# EAGLE design PS4-sequencer (EAGLE 9.7.0)
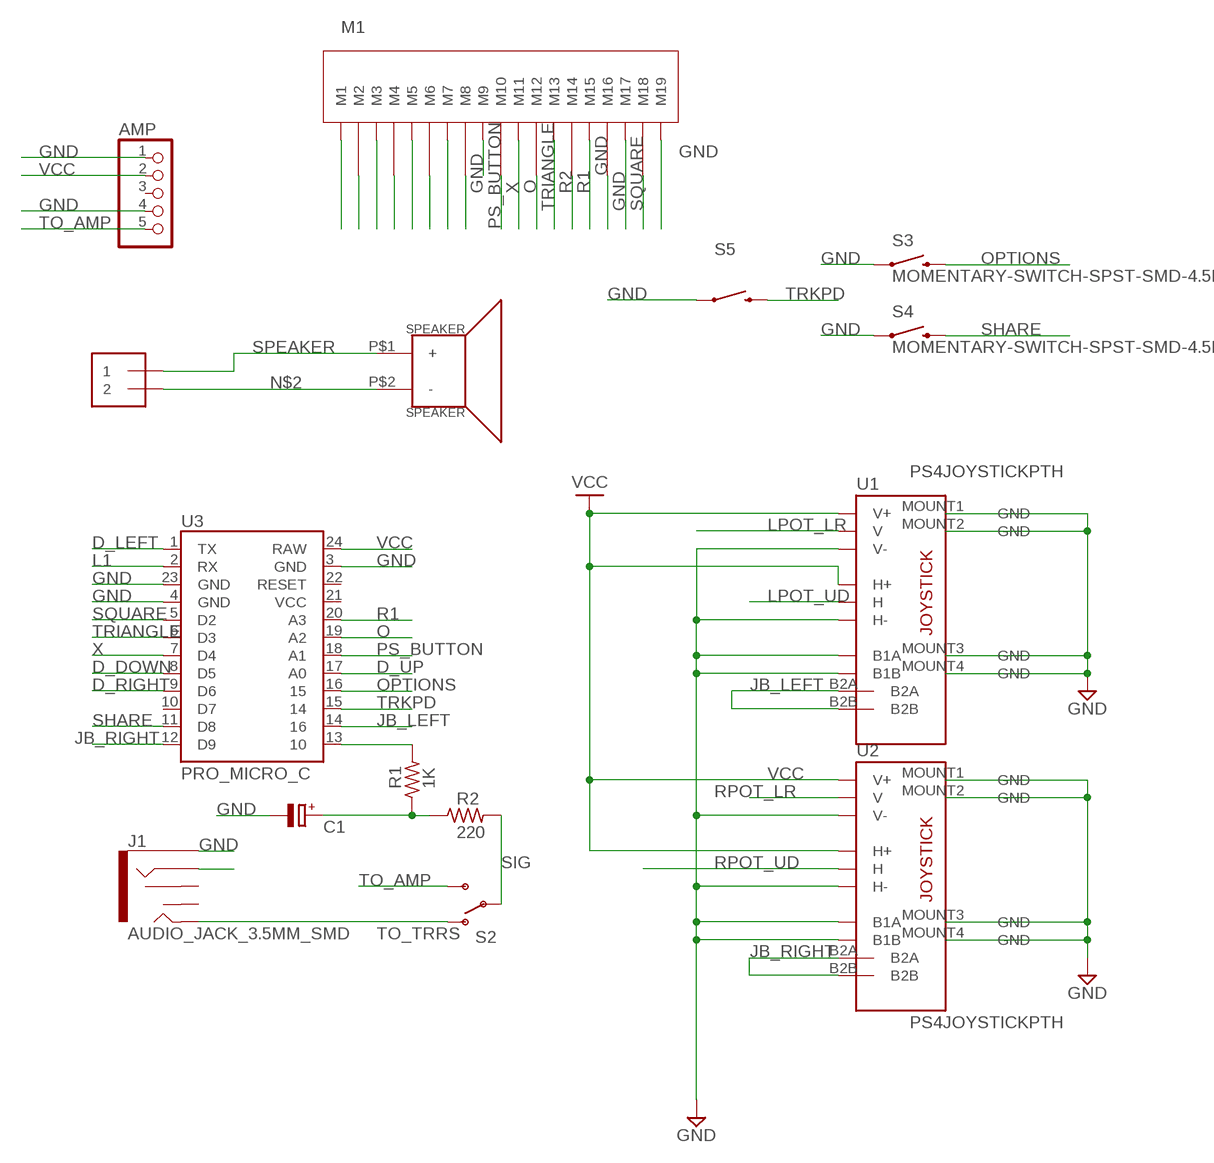
[diagram p0: schematic, sheet 1]

## Parts
AMP  PINHD-1X5  [1X05]
C1  CAPACITOR-POLRADIAL-5MM-DIA  [CAPPRD254W65D500H1150B]
J1  AUDIO_JACK_3.5MM_SMD  [AUDIO-JACK-3.5MM-SMD]
J2  1X2-3.5MM  [1X2-3.5MM]
M1  PS4MEMBRANE  [PS4MEMBRANE]
R1  1K  R-US_AXIAL-7.2MM-PITCH  [RESAD724W46L381D178B]
R2  220  R-US_AXIAL-7.2MM-PITCH  [RESAD724W46L381D178B]
S2  SWITCH-SPDTSMD  [SWITCH_SPDT_SMD]
S3  MOMENTARY-SWITCH-SPST-SMD-4.5MM  [TACTILE_SWITCH_SMD_3.6MM]
S4  MOMENTARY-SWITCH-SPST-SMD-4.5MM  [TACTILE_SWITCH_SMD_3.6MM]
S5  TAC_SWITCHSMD  MOMENTARY-SWITCH-SPST-SMD-5.2MM  [TACTILE_SWITCH_SMD_6MM]
SPEAKER  SPEAKER  [PS4_SPEAKER]
U1  PS4JOYSTICKPTH  [PS4JOYSTICK]
U2  PS4JOYSTICKPTH  [PS4JOYSTICK]
U3  PRO_MICRO_C  [PRO_MICRO_C]

## Nets
D_DOWN: M1.8(M8) U3.8(D5)
D_LEFT: M1.7(M7) U3.1(TX)
D_RIGHT: M1.5(M5) U3.9(D6)
D_UP: M1.6(M6) U3.17(A0)
GND: AMP.1 AMP.4 C1.2(-) J1.SLEEVE M1.3(M3) M1.9(M9) M1.16(M16) M1.17(M17) M1.19(M19) S3.2 S3.3 S4.2 S4.3 S5.1 U1.B1A U1.B1B U1.H3(H-) U1.MOUNT1(GND) U1.MOUNT2(GND) U1.MOUNT3(GND) U1.MOUNT4(GND) U1.V3(V-) U2.B1A U2.B1B U2.H3(H-) U2.MOUNT1(GND) U2.MOUNT2(GND) U2.MOUNT3(GND) U2.MOUNT4(GND) U2.V3(V-) U3.3(GND) U3.4(GND) U3.23(GND)
JB_LEFT: U1.B2A U1.B2B U3.14
JB_RIGHT: U2.B2A U2.B2B U3.12(D9)
L1: M1.2(M2) U3.2(RX)
L2: M1.1(M1)
LPOT_LR: U1.V2(V)
LPOT_UD: U1.H2(H)
N$1: C1.1(+) R1.1 R2.1
N$2: J2.2 SPEAKER.P$2(-)
N$4: J1.RING1(RING)
N$8: R1.2 U3.13
N$24: M1.4(M4)
O: M1.12(M12) U3.19(A2)
OPTIONS: S3.1 S3.4 U3.16
PS_BUTTON: M1.10(M10) U3.18(A1)
R1: M1.15(M15) U3.20(A3)
R2: M1.14(M14)
RPOT_LR: U2.V2(V)
RPOT_UD: U2.H2(H)
SHARE: S4.1 S4.4 U3.11(D8)
SIG: R2.2 S2.2(P)
SPEAKER: J2.1 SPEAKER.P$1(+)
SQUARE: M1.18(M18) U3.5(D2)
TO_AMP: AMP.5 S2.3(S)
TO_TRRS: J1.TIP S2.1(O)
TRIANGLE: M1.13(M13) U3.6(D3)
TRKPD: S5.3 U3.15
VCC: AMP.2 U1.H1(H+) U1.V1(V+) U2.H1(H+) U2.V1(V+) U3.24(RAW)
X: M1.11(M11) U3.7(D4)
Unconnected: AMP.3 J1.RSH J1.TSH U3.10(D7) U3.21(VCC) U3.22(RESET)

## Library data of the parts
AMP = pinhead:PINHD-1X5: PIN HEADER
C1 = Tinkercad:CAPACITOR-POL: Capacitor Polarised - Generic
J1 = controller:AUDIO_JACK_3.5MM: Audio Jack 3.5mm variants of PTH and SMT stereo audio jack with bypass switches. SparkFun Products: SparkFun SparkPunk Sound Kit <[https://www.sparkfun.com/products/11177]> - PTH MP3 Trigger <https://www.sparkfun.com/products/13720> -3.5mm SMD SparkFun PicoBoard <https://www.sparkfun.com/products/11888>- 2.5mm SMD; PROD_ID: CONN-10353
J2 = adafruit:1X2: 3.5mm Terminal block http://www.ladyada.net/library/pcb/eaglelibrary.html
M1 = controller:PS4MEMBRANE
R1 R2 = Tutorial - Fusion 360:R-US: Resistor Fixed - ANSI; CATEGORY: Resistor; SUB-CATEGORY: Fixed
S2 = controller:SWITCH-SPDT: SPDT Switch Simple slide switch, Spark Fun Electronics SKU : COM-00102 DPDT SMT slide switch, AYZ0202, SWCH-08179
S3 S4 = controller:MOMENTARY-SWITCH-SPST: Momentary Switch (Pushbutton) - SPST Normally-open (NO) SPST momentary switches (buttons, pushbuttons). Variants PTH-12MM - 12mm square, through-hole Momentary Pushbutton Switch - 12mm Square <https://www.sparkfun.com/products/9190> (COM-09190) PTH-6.0MM, PTH-6.0MM-KIT - 6.0mm square, through-hole Mini Pushbutton Switch <https://www.sparkfun.com/products/97> (COM-00097) KIT package intended for soldering kit's - only one side of pads' copper is exposed. PTH-RIGHT-ANGLE-KIT - Right-angle, through-hole Right Angle Tactile Button <https://www.sparkfun.com/products/10791> - Used on SparkFun BigTime Watch Kit <https://www.sparkfun.com/products/11734> SMD-12MM - 12mm square, surface-mount Tactile Button - SMD (12mm) <https://www.sparkfun.com/products/12993> (COM-12993) Used on SparkFun PicoBoard <https://www.sparkfun.com/products/11888> SMD-4.5MM - 4.5mm Square Trackball Switch Used on SparkFun Blackberry Trackballer Breakout <https://www.sparkfun.com/products/13169> SMD-4.6MMX2.8MM - 4.60mm x 2.80mm, surface mount Used on SparkFun SAMD21 Mini Breakout <https://www.sparkfun.com/products/13664> SMD-5.2MM, SMD-5.2-REDUNDANT - 5.2mm square, surface-mount Mini Pushbutton Switch - SMD <https://www.sparkfun.com/products/8720> (COM-08720) Used on Arduino Pro Mini <https://www.sparkfun.com/products/11114> REDUNDANT package connects both switch circuits together SMD-6.0X3.5MM - 6.0 x 3.5mm, surface mount Momentary Reset Switch SMD <https://www.sparkfun.com/products/8229> (COM-08229) SMD-6.2MM-TALL - 6.2mm square, surface mount Tactile Button - SMD (6mm) <https://www.sparkfun.com/products/12992> Used on SparkFun Digital Sandbox <https://www.sparkfun.com/products/12651> SMD-RIGHT-ANGLE - Right-angle, surface mount Used on SparkFun Block for Intel® Edison - Arduino <https://www.sparkfun.com/products/13036>; PROD_ID: SWCH-09213
S5 = controller:MOMENTARY-SWITCH-SPST: Momentary Switch (Pushbutton) - SPST Normally-open (NO) SPST momentary switches (buttons, pushbuttons). Variants PTH-12MM - 12mm square, through-hole Momentary Pushbutton Switch - 12mm Square <https://www.sparkfun.com/products/9190> (COM-09190) PTH-6.0MM, PTH-6.0MM-KIT - 6.0mm square, through-hole Mini Pushbutton Switch <https://www.sparkfun.com/products/97> (COM-00097) KIT package intended for soldering kit's - only one side of pads' copper is exposed. PTH-RIGHT-ANGLE-KIT - Right-angle, through-hole Right Angle Tactile Button <https://www.sparkfun.com/products/10791> - Used on SparkFun BigTime Watch Kit <https://www.sparkfun.com/products/11734> SMD-12MM - 12mm square, surface-mount Tactile Button - SMD (12mm) <https://www.sparkfun.com/products/12993> (COM-12993) Used on SparkFun PicoBoard <https://www.sparkfun.com/products/11888> SMD-4.5MM - 4.5mm Square Trackball Switch Used on SparkFun Blackberry Trackballer Breakout <https://www.sparkfun.com/products/13169> SMD-4.6MMX2.8MM - 4.60mm x 2.80mm, surface mount Used on SparkFun SAMD21 Mini Breakout <https://www.sparkfun.com/products/13664> SMD-5.2MM, SMD-5.2-REDUNDANT - 5.2mm square, surface-mount Mini Pushbutton Switch - SMD <https://www.sparkfun.com/products/8720> (COM-08720) Used on Arduino Pro Mini <https://www.sparkfun.com/products/11114> REDUNDANT package connects both switch circuits together SMD-6.0X3.5MM - 6.0 x 3.5mm, surface mount Momentary Reset Switch SMD <https://www.sparkfun.com/products/8229> (COM-08229) SMD-6.2MM-TALL - 6.2mm square, surface mount Tactile Button - SMD (6mm) <https://www.sparkfun.com/products/12992> Used on SparkFun Digital Sandbox <https://www.sparkfun.com/products/12651> SMD-RIGHT-ANGLE - Right-angle, surface mount Used on SparkFun Block for Intel® Edison - Arduino <https://www.sparkfun.com/products/13036>; PROD_ID: SWCH-08247; SF_SKU: COM-08720
SPEAKER = controller:SPEAKER: Speaker Generic 2-terminal loudspeakers SparkFun Products Speaker - PCB Mount <https://www.sparkfun.com/products/11089> (COM-11089)
U1 U2 = ps4joystick:PS4JOYSTICK: Thumb Joystick Joystick commonly found in PS2 controllers. Two pots and a select switch. Adapted from Sparkfun Library (but for more common 6mm switch sticks)
U3 = SparkFun-Boards:PRO_MICRO_C

## Board
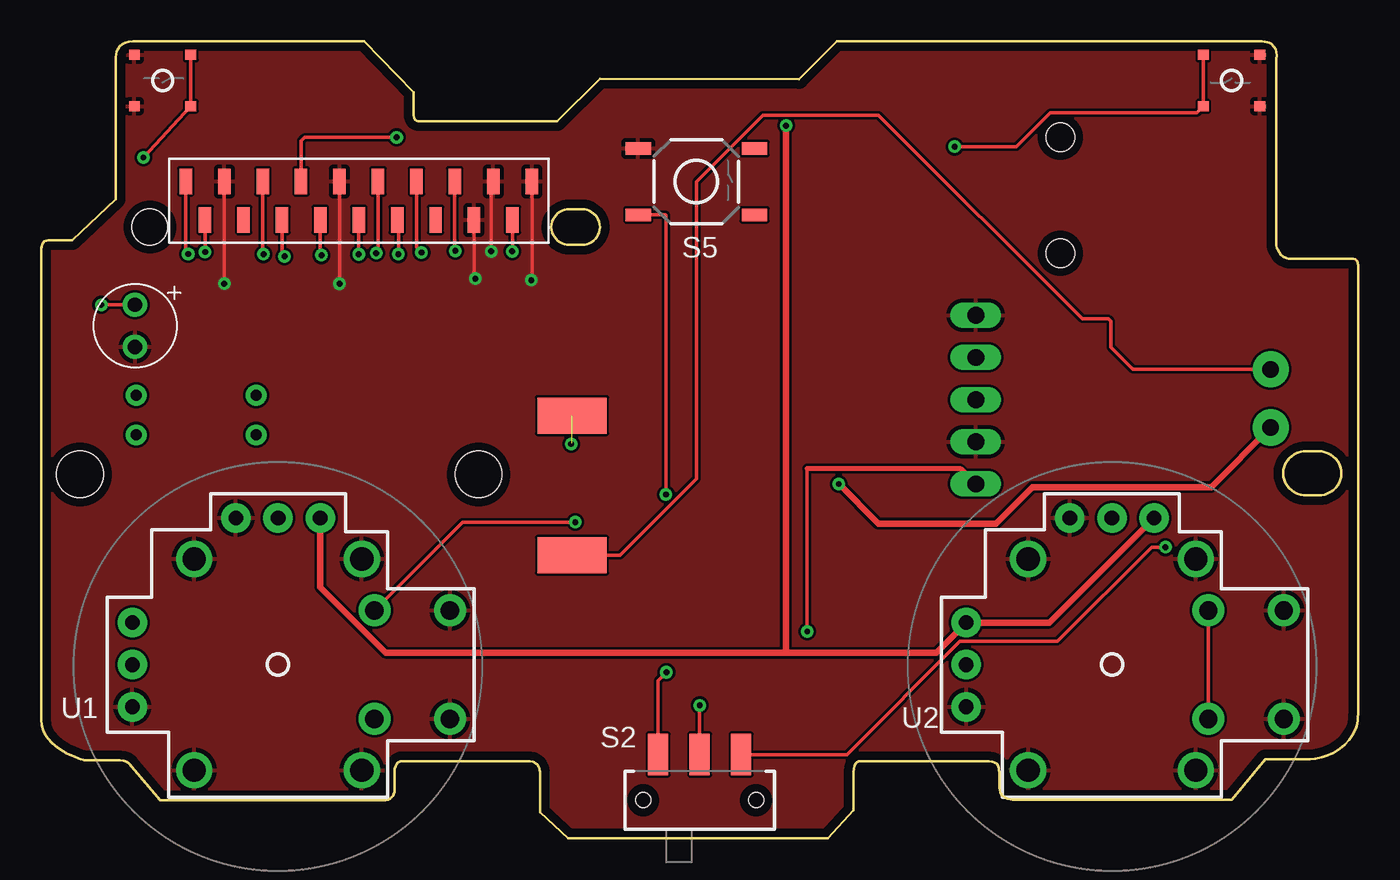
[diagram p1: board, top side]
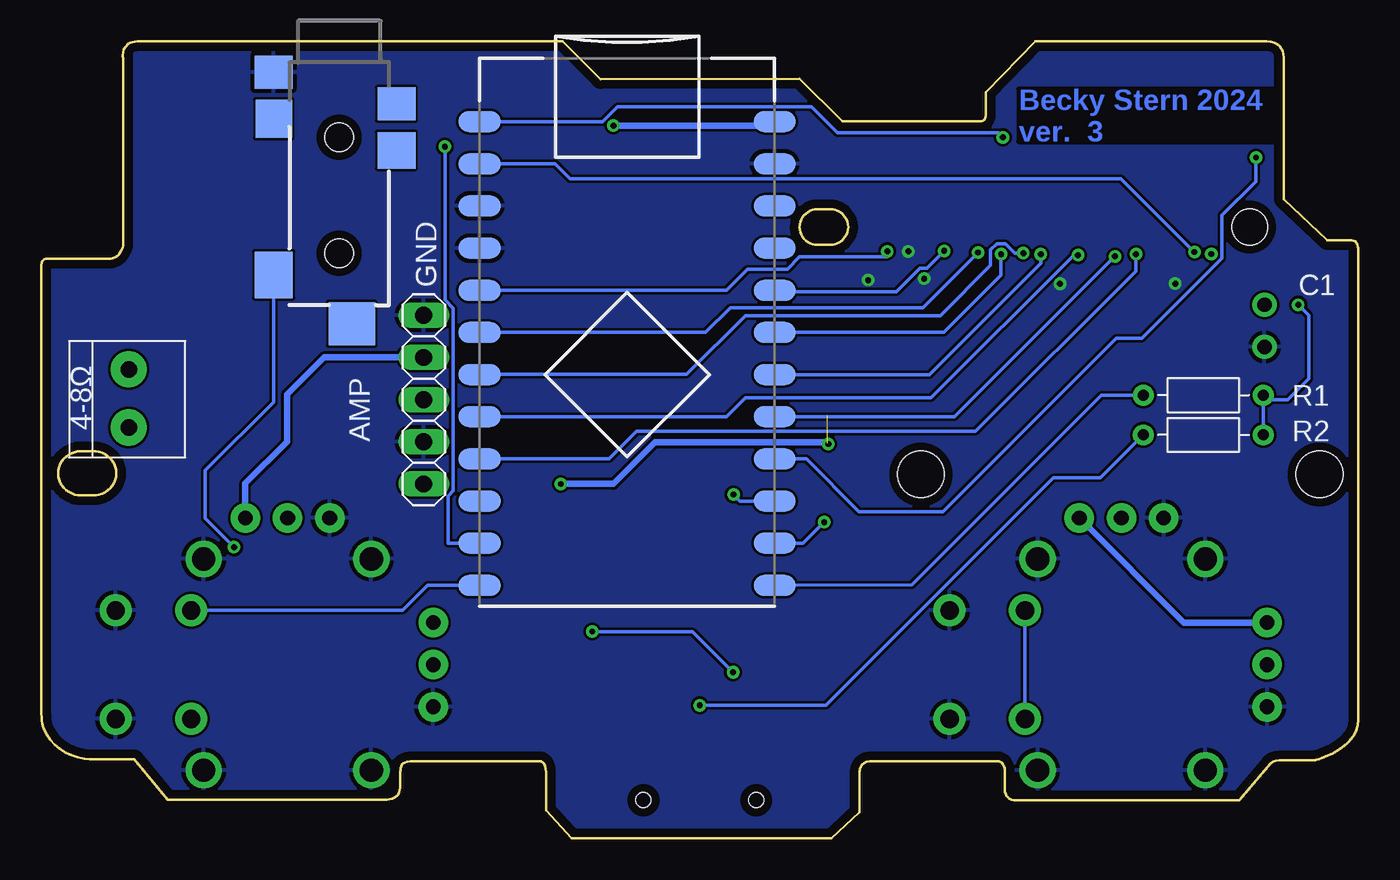
[diagram p2: board, bottom side, seen from below]

Size 79.35 x 47.99 mm. Coordinates in mm from the lower left corner, seen from the top.
Outline: 33.65,36.81 33.64,36.65 33.61,36.5 33.55,36.36 33.48,36.22 33.38,36.1 33.28,36 33.16,35.91 33.02,35.83 32.88,35.78 32.72,35.75 32.64,35.74 32.62,35.74 32.61,35.74 32.58,35.74 32.51,35.74 32.42,35.74 32.21,35.74 31.99,35.74 31.9,35.74 31.84,35.74 31.8,35.74 31.8,35.74 31.77,35.74 31.69,35.75 31.53,35.78 31.38,35.83 31.24,35.9 31.12,35.99 31.01,36.09 30.91,36.21 30.83,36.35 30.78,36.49 30.74,36.65 30.73,36.81 30.74,36.97 30.78,37.13 30.83,37.28 30.91,37.41 31.01,37.53 31.12,37.64 31.24,37.73 31.38,37.8 31.53,37.85 31.69,37.88 31.77,37.88 31.8,37.88 31.8,37.88 31.84,37.88 31.9,37.88 31.99,37.88 32.21,37.88 32.43,37.88 32.52,37.88 32.59,37.88 32.62,37.88 32.63,37.88 32.65,37.88 32.73,37.87 32.88,37.84 33.03,37.79 33.16,37.71 33.28,37.62 33.39,37.52 33.48,37.4 33.55,37.27 33.61,37.12 33.64,36.97 33.65,36.81
Outline: 78.34,21.97 78.33,21.78 78.28,21.59 78.21,21.41 78.11,21.24 78,21.09 77.86,20.96 77.7,20.85 77.53,20.76 77.34,20.69 77.14,20.65 77.04,20.64 77.01,20.64 77,20.64 77,20.64 76.97,20.64 76.9,20.64 76.82,20.64 76.62,20.64 76.42,20.64 76.34,20.64 76.27,20.64 76.24,20.64 76.24,20.64 76.23,20.64 76.2,20.64 76.09,20.64 75.89,20.68 75.69,20.74 75.51,20.83 75.34,20.94 75.2,21.08 75.07,21.23 74.97,21.39 74.9,21.58 74.85,21.77 74.84,21.97 74.85,22.18 74.9,22.37 74.97,22.55 75.07,22.72 75.2,22.87 75.34,23.01 75.51,23.12 75.69,23.21 75.89,23.27 76.09,23.31 76.2,23.31 76.23,23.31 76.24,23.31 76.24,23.31 76.28,23.31 76.34,23.31 76.42,23.31 76.63,23.31 76.83,23.31 76.92,23.31 76.98,23.31 77.01,23.31 77.02,23.31 77.03,23.31 77.05,23.31 77.16,23.3 77.35,23.25 77.54,23.19 77.71,23.09 77.86,22.98 78,22.85 78.12,22.7 78.21,22.54 78.28,22.36 78.33,22.17 78.34,21.97
Outline: 5.53,47.99 5.27,47.97 5.05,47.91 4.87,47.82 4.73,47.69 4.62,47.55 4.54,47.39 4.49,47.22 4.48,47.04 4.48,46.99 4.48,46.9 4.48,46.77 4.48,46.6 4.48,46.39 4.48,46.16 4.48,45.89 4.48,45.6 4.48,45.28 4.48,44.94 4.48,44.22 4.48,43.45 4.48,42.67 4.48,41.88 4.48,41.13 4.48,40.42 4.48,40.09 4.48,39.79 4.48,39.51 4.48,39.25 4.48,39.03 4.48,38.84 4.48,38.69 4.48,38.58 4.48,38.51 4.48,38.49 1.87,36.01 1.85,36.01 1.82,36.01 1.7,36.01 1.51,36.01 1.29,36.01 0.81,36.01 0.59,36.01 0.41,36.01 0.27,35.99 0.17,35.94 0.1,35.87 0.05,35.79 0.01,35.64 0,35.59 0,35.57 0,35.55 0,35.49 0,35.4 0,35.27 0,35.11 0,34.91 0,34.68 0,34.42 0,34.13 0,33.82 0,33.47 0,33.1 0,32.71 0,32.29 0,31.85 0,31.38 0,30.4 0,29.34 0,28.22 0,27.05 0,25.84 0,24.59 0,22.04 0,19.46 0,18.18 0,16.93 0,15.71 0,14.54 0,13.41 0,12.34 0,11.35 0,10.88 0,10.43 0,10.01 0,9.6 0,9.23 0,8.88 0,8.55 0,8.25 0,7.99 0,7.75 0,7.54 0,7.37 0,7.23 0,7.13 0.03,6.8 0.11,6.5 0.24,6.22 0.41,5.97 0.61,5.75 0.83,5.55 1.06,5.37 1.31,5.22 1.55,5.09 1.79,4.97 2.01,4.88 2.2,4.81 2.37,4.75 2.5,4.71 2.58,4.69 2.61,4.68 2.63,4.68 2.69,4.68 2.78,4.68 2.89,4.68 3.19,4.68 3.54,4.68 3.9,4.68 4.25,4.68 4.53,4.68 4.64,4.68 4.72,4.68 4.95,4.65 5.13,4.58 5.25,4.51 5.28,4.49 5.29,4.48 7.16,2.27 7.2,2.27 7.31,2.27 7.48,2.27 7.72,2.27 8.01,2.27 8.36,2.27 8.75,2.27 9.19,2.27 9.66,2.27 10.17,2.27 10.71,2.27 11.28,2.27 12.46,2.27 13.69,2.27 14.92,2.27 16.12,2.27 16.69,2.27 17.25,2.27 17.78,2.27 18.27,2.27 18.73,2.27 19.15,2.27 19.53,2.27 19.85,2.27 20.13,2.27 20.34,2.27 20.49,2.27 20.57,2.27 20.73,2.29 20.88,2.32 21,2.37 21.1,2.45 21.18,2.54 21.24,2.65 21.27,2.78 21.28,2.92 21.28,3.05 21.28,3.16 21.28,3.36 21.28,3.47 21.28,3.6 21.28,3.77 21.28,3.97 21.3,4.17 21.34,4.33 21.4,4.44 21.47,4.52 21.53,4.57 21.59,4.6 21.64,4.61 21.65,4.62 21.67,4.62 21.73,4.62 21.83,4.62 21.96,4.62 22.12,4.62 22.32,4.62 22.53,4.62 22.78,4.62 23.33,4.62 23.94,4.62 24.61,4.62 25.3,4.62 26.68,4.62 27.34,4.62 27.94,4.62 28.21,4.62 28.47,4.62 28.7,4.62 28.91,4.62 29.08,4.62 29.23,4.62 29.35,4.62 29.43,4.62 29.64,4.59 29.79,4.52 29.9,4.41 29.97,4.29 30.01,4.17 30.03,4.07 30.04,4 30.04,3.97 30.04,1.56 31.73,0 47.41,0 48.94,1.66 48.94,1.68 48.94,1.74 48.94,1.83 48.94,1.94 48.94,2.24 48.94,2.6 48.94,3.37 48.94,3.71 48.94,3.85 48.94,3.97 48.95,4.16 48.99,4.32 49.04,4.43 49.09,4.51 49.15,4.56 49.2,4.6 49.23,4.61 49.25,4.62 49.27,4.62 49.33,4.62 49.42,4.62 49.56,4.62 49.72,4.62 49.92,4.62 50.14,4.62 50.38,4.62 50.94,4.62 51.56,4.62 52.23,4.62 52.93,4.62 54.33,4.62 54.99,4.62 55.6,4.62 55.88,4.62 56.14,4.62 56.37,4.62 56.58,4.62 56.76,4.62 56.91,4.62 57.02,4.62 57.1,4.62 57.31,4.6 57.47,4.54 57.58,4.47 57.65,4.38 57.69,4.29 57.71,4.21 57.71,4.16 57.71,4.14 57.71,4.12 57.72,4.08 57.72,3.99 57.73,3.87 57.74,3.72 57.74,3.52 57.74,3.29 57.75,3.02 57.76,2.88 57.79,2.77 57.83,2.67 57.89,2.58 58.05,2.45 58.22,2.37 58.4,2.33 58.55,2.31 58.66,2.31 58.7,2.31 71.75,2.31 73.75,4.75 76.43,4.75 76.78,4.78 77.15,4.85 77.52,4.98 77.89,5.15 78.24,5.37 78.56,5.63 78.84,5.93 79.06,6.28 79.23,6.67 79.29,6.87 79.33,7.09 79.35,7.32 79.35,7.44 79.35,7.62 79.35,7.87 79.35,8.2 79.35,8.58 79.35,9.03 79.35,9.53 79.35,10.08 79.35,10.69 79.35,11.34 79.35,12.04 79.35,12.77 79.35,13.54 79.35,14.34 79.35,15.16 79.35,16.01 79.35,17.77 79.35,19.58 79.35,21.41 79.35,23.23 79.35,25.01 79.35,25.88 79.35,26.73 79.35,27.56 79.35,28.35 79.35,29.12 79.35,29.85 79.35,30.54 79.35,31.19 79.35,31.79 79.35,32.34 79.35,32.84 79.35,33.28 79.35,33.66 79.35,33.98 79.35,34.23 79.35,34.4 79.35,34.5 79.35,34.54 79.35,34.6 79.32,34.7 79.29,34.78 79.18,34.87 79.07,34.9 78.98,34.9 78.94,34.89 78.91,34.89 78.82,34.89 78.67,34.89 78.48,34.89 78.25,34.89 77.99,34.89 77.41,34.89 76.79,34.89 76.19,34.89 75.92,34.89 75.68,34.89 75.47,34.89 75.31,34.89 75.18,34.9 75.06,34.92 74.86,35.02 74.7,35.15 74.59,35.3 74.51,35.45 74.46,35.58 74.44,35.67 74.43,35.7 74.43,35.74 74.43,35.83 74.43,35.98 74.43,36.19 74.43,36.44 74.43,36.74 74.42,37.09 74.42,37.47 74.42,37.88 74.42,38.32 74.42,38.78 74.42,39.27 74.42,40.29 74.42,41.34 74.41,42.39 74.41,43.42 74.41,43.9 74.41,44.37 74.41,44.81 74.41,45.23 74.42,45.61 74.42,45.95 74.42,46.25 74.42,46.51 74.42,46.72 74.42,46.87 74.43,46.97 74.43,47.01 74.44,47.06 74.45,47.17 74.43,47.33 74.38,47.51 74.28,47.69 74.12,47.84 74.01,47.9 73.88,47.95 73.72,47.98 73.55,47.99 47.94,47.99 45.65,45.72 33.65,45.76 31.09,43.17 31.08,43.17 31.04,43.17 30.97,43.17 30.89,43.17 30.78,43.17 30.66,43.17 30.35,43.17 29.97,43.17 29.54,43.17 29.06,43.17 28.54,43.17 27.43,43.17 26.29,43.17 25.73,43.17 25.19,43.17 24.68,43.17 24.22,43.17 23.8,43.17 23.44,43.17 23.15,43.17 23.04,43.17 22.94,43.17 22.87,43.17 22.83,43.17 22.78,43.17 22.71,43.18 22.6,43.21 22.51,43.29 22.46,43.4 22.43,43.55 22.43,43.76 22.43,44.03 22.43,44.34 22.43,44.63 22.43,44.75 22.43,44.85 22.43,44.91 22.43,44.93 19.44,47.99 5.53,47.99
Copper layers (1*16): Top 0.035mm / dielectric 1.5mm / Bottom 0.035mm
Design rules "Fusion Electronics Design Rules": minimum track width 8mil, minimum drill 0.35mm, track to track 6mil, track to pad 6mil, pad to pad 6mil, via to via 6mil, smd to smd 6mil, copper to edge 20mil, drill to drill 10mil, minimum pad ring 10mil, minimum via ring 8mil, stop-mask expansion 4mil, vias tented up to drill 20mil, thermal gap 10mil
Holes 2.8 mm at 26.35,21.91 2.32,21.91
Holes 2.14 mm at 6.53,36.81

### Footprints (pad centres in the part's own frame; a part is rotated, then mirrored left to right if it is on the bottom)
1X05 = drill 1.016 long: 1 -5.08,0; 2 -2.54,0; 3 0,0; 4 2.54,0; 5 5.08,0
CAPPRD254W65D500H1150B = drill 0.85 pad 1.45: 1 -1.27,0; 2 1.27,0
AUDIO-JACK-3.5MM-SMD = smd 2.2 x 2.3: RING1 5.3,3.45 | smd 2.3 x 2.2: RING2 3.4,-3.95 | smd 2 x 2.3: RSH 2.5,3.45; SLEEVE 0.6,-3.95 | smd 2.8 x 2.3: TIP 12.8,-3.95 | smd 2.6 x 2.8: TSH 15.75,0.75 | hole 1.7: 4.5,0; 11.5,0
1X2-3.5MM = drill 1 pad 2.184: 1 1.8,0; 2 -1.7,0
PS4MEMBRANE = smd 0.752 x 1.529: 1 -10.431,1.161; 2 -9.262,-1.161; 3 -8.105,1.161; 4 -6.947,-1.161; 5 -5.789,1.161; 6 -4.631,-1.161; 7 -3.473,1.161; 8 -2.316,-1.161; 9 -1.158,1.161; 10 0,-1.161; 11 1.158,1.161; 12 2.316,-1.161; 13 3.473,1.161; 14 4.631,-1.161; 15 5.789,1.161; 16 6.947,-1.161; 17 8.105,1.161; 18 9.262,-1.161; 19 10.431,1.161
RESAD724W46L381D178B = drill 0.66 pad 1.26: 1 -3.62,0; 2 3.62,0
SWITCH_SPDT_SMD = smd 1.2 x 2.5: 1 -2.5,-2.75; 2 0,-2.75; 3 2.5,-2.75 | hole 0.9: -3.4,0; 3.4,0
TACTILE_SWITCH_SMD_3.6MM = smd 0.6 x 0.65: 1 1.55,1.7; 2 1.55,-1.7; 3 -1.55,-1.7; 4 -1.55,1.7
TACTILE_SWITCH_SMD_6MM = smd 1.524 x 0.762: 1 -3.5,2; 2 3.5,2; 3 -3.5,-2; 4 3.5,-2
PS4_SPEAKER = smd 4.166 x 2.159: P$1 -0.076,4.242; P$2 -0.076,-4.166
PS4JOYSTICK = drill 1.1 pad 1.93: B1A -3.269,10.362; B1B 3.269,10.362; B2A -3.269,5.81; B2B 3.269,5.81 | drill 0.889 pad 1.778: H1 -2.54,-8.781; H2 0,-8.781; H3 2.54,-8.781; V1 -8.838,2.54; V2 -8.838,0; V3 -8.838,-2.54 | drill 1.397 pad 2.184: MOUNT1 -6.367,5.049; MOUNT2 -6.367,-5.049; MOUNT3 6.367,-5.049; MOUNT4 6.367,5.049
PRO_MICRO_C = smd 2.54 x 1.27: 1 -8.89,12.7; 2 -8.89,10.16; 3 -8.89,7.62; 4 -8.89,5.08; 5 -8.89,2.54; 6 -8.89,0; 7 -8.89,-2.54; 8 -8.89,-5.08; 9 -8.89,-7.62; 10 -8.89,-10.16; 11 -8.89,-12.7; 12 -8.89,-15.24; 13 8.89,-15.24; 14 8.89,-12.7; 15 8.89,-10.16; 16 8.89,-7.62; 17 8.89,-5.08; 18 8.89,-2.54; 19 8.89,0; 20 8.89,2.54; 21 8.89,5.08; 22 8.89,7.62; 23 8.89,10.16; 24 8.89,12.7

### Placement (x,y rotation side)
AMP  56.31,26.41 270 bottom
C1  5.64,30.86 270 top
J1  61.41,46.73 270 bottom
J2  74.09,26.54 270 bottom
M1  19.12,38.4 0 top
R1  9.32,26.68 180 bottom
R2  9.32,24.28 180 bottom
S2  39.67,2.28 180 top
S3  7.3,45.64 270 top
S4  71.73,45.64 90 top
S5  39.47,39.54 0 top
SPEAKER  32.05,21.2 0 top
U1  14.26,10.44 270 top
U2  64.52,10.44 270 top
U3  44.05,30.46 0 bottom

### Tracks (layer width: path | path; a pad name or v marks a point on that pad's centre or on a via)
D_DOWN  (via drill 0.35)
  Top 0.203: v16.88,35.11 16.81,35.18 M1.8
  Bottom 0.203: U3.8 38.07,25.38 36.93,26.52 25.73,26.52 17.14,35.11 v16.88,35.11
D_LEFT  (via drill 0.35)
  Top 0.203: M1.7 15.65,42.01 15.85,42.22 v21.4,42.22
  Bottom 0.203: U3.1 45.53,43.16 44.64,44.05 32.94,44.05 31.37,42.48 21.67,42.48 v21.4,42.22
D_RIGHT  (via drill 0.35)
  Top 0.203: M1.5 13.33,35.22 v13.38,35.17
  Bottom 0.203: v13.38,35.17 13.38,34.16 23.05,24.49 43.49,24.49 45.14,22.84 U3.9
D_UP  (via drill 0.35)
  Top 0.203: M1.6 14.49,35.21 v14.65,35.05
  Bottom 0.203: U3.17 24.32,25.38 v14.65,35.05
GND  (via drill 0.35)
  Top 0.203: M1.3 v11.02,33.4 | M1.9 v17.97,33.39 | M1.17 27.1,39.43 v27.1,35.35 | M1.16 26.07,33.78 v26.15,33.7 | v29.52,33.61 29.55,33.64 M1.19
  pour Top: 21.66,4.72 21.66,4.72 29.41,4.72 29.42,4.72 29.43,4.72 29.45,4.72 29.45,4.71 29.65,4.69 29.66,4.69 29.67,4.69 29.67,4.69 29.68,4.68 29.83,4.61 29.85,4.6 29.85,4.6 29.85,4.6 29.87,4.59 29.97,4.49 29.98,4.48 29.98,4.48 29.99,4.47 29.99,4.46 30.06,4.35 30.06,4.35 30.07,4.34 30.07,4.33 30.07,4.32 30.11,4.22 30.11,4.21 30.11,4.2 30.12,4.19 30.12,4.18 30.13,4.1 30.13,4.1 30.13,4.08 30.14,4.07 30.13,4.06 30.14,4.02 30.14,4.02 30.14,4 30.14,3.99 30.14,3.98 30.14,3.97 30.14,1.61 31.77,0.1 47.37,0.1 48.84,1.7 48.84,3.95 48.84,3.96 48.84,3.97 48.84,3.99 48.84,3.99 48.85,4.16 48.85,4.17 48.85,4.18 48.85,4.19 48.86,4.2 48.89,4.33 48.89,4.34 48.89,4.35 48.89,4.36 48.9,4.37 48.94,4.46 48.94,4.47 48.95,4.48 48.95,4.49 48.96,4.49 49,4.56 49.01,4.57 49.02,4.58 49.02,4.58 49.03,4.59 49.07,4.63 49.08,4.64 49.09,4.64 49.09,4.65 49.1,4.65 49.13,4.67 49.14,4.68 49.15,4.69 49.16,4.69 49.17,4.69 49.18,4.7 49.18,4.7 49.2,4.71 49.21,4.71 49.21,4.71 49.23,4.72 49.23,4.72 49.24,4.72 49.25,4.72 57.09,4.72 57.09,4.72 57.11,4.72 57.12,4.72 57.13,4.72 57.31,4.7 57.33,4.7 57.33,4.7 57.34,4.69 57.35,4.69 57.5,4.64 57.51,4.64 57.52,4.63 57.52,4.63 57.53,4.62 57.63,4.55 57.64,4.55 57.65,4.54 57.65,4.54 57.66,4.52 57.72,4.45 57.73,4.44 57.74,4.43 57.74,4.43 57.74,4.41 57.78,4.34 57.78,4.33 57.79,4.32 57.79,4.32 57.79,4.31 57.8,4.25 57.81,4.24 57.81,4.23 57.81,4.22 57.81,4.21 57.81,4.19 57.81,4.18 57.81,4.17 57.82,4.15 57.81,4.15 57.82,4.13 57.82,4.11 57.82,4.11 57.82,4.1 57.82,4.1 57.82,4.08 57.82,4.06 57.82,4.06 57.82,4.02 57.82,4.02 57.82,4 57.83,3.98 57.83,3.98 57.83,3.9 57.83,3.9 57.83,3.88 57.83,3.86 57.83,3.86 57.84,3.74 57.84,3.74 57.84,3.72 57.84,3.7 57.84,3.7 57.84,3.55 57.84,3.55 57.84,3.53 57.84,3.51 57.84,3.51 57.85,3.31 57.85,3.31 57.85,3.29 57.85,3.27 57.85,3.27 57.85,3.02 57.86,2.9 57.88,2.8 57.92,2.72 57.97,2.65 58.1,2.54 58.26,2.47 58.41,2.43 58.56,2.41 58.66,2.41 58.67,2.41 58.68,2.41 58.7,2.41 58.71,2.41 58.72,2.41 71.7,2.41 73.66,4.8 73.66,4.81 73.67,4.82 73.68,4.83 73.69,4.83 73.69,4.84 73.71,4.84 73.72,4.85 73.73,4.85 73.73,4.85 73.74,4.85 73.76,4.85 73.77,4.85 76.43,4.85 76.77,4.88 77.13,4.95 77.49,5.07 77.84,5.24 78.18,5.45 78.49,5.7 78.76,6 78.98,6.33 79.14,6.7 79.19,6.9 79.23,7.11 79.25,7.33 79.25,7.44 79.25,34.5 79.25,34.53 79.24,34.58 79.23,34.67 79.2,34.71 79.13,34.77 79.06,34.79 78.99,34.79 78.97,34.79 78.96,34.79 78.95,34.79 78.94,34.79 78.93,34.79 75.33,34.79 75.32,34.79 75.31,34.79 75.29,34.79 75.29,34.79 75.18,34.8 75.18,34.8 75.16,34.8 75.15,34.8 75.14,34.8 75.05,34.82 75.03,34.82 75.03,34.83 75.02,34.83 75.01,34.84 74.82,34.92 74.81,34.93 74.8,34.93 74.8,34.93 74.79,34.94 74.65,35.06 74.64,35.07 74.63,35.08 74.62,35.08 74.62,35.09 74.52,35.23 74.51,35.23 74.5,35.24 74.5,35.25 74.49,35.26 74.43,35.39 74.42,35.39 74.42,35.4 74.41,35.42 74.41,35.42 74.37,35.53 74.37,35.53 74.37,35.55 74.36,35.56 74.36,35.56 74.34,35.63 74.34,35.63 74.34,35.65 74.33,35.66 74.33,35.66 74.33,35.67 74.33,35.68 74.33,35.69 74.33,35.7 74.33,35.71 74.33,35.72 74.33,35.72 74.33,35.84 74.33,35.96 74.33,35.96 74.33,35.97 74.33,36 74.33,36 74.33,36.17 74.33,36.17 74.33,36.46 74.33,36.46 74.32,36.72 74.32,36.72 74.32,37.11 74.32,37.11 74.32,37.44 74.32,37.44 74.32,37.86 74.32,37.86 74.32,38.3 74.32,38.3 74.32,38.3 74.32,38.34 74.32,38.34 74.32,38.8 74.32,38.8 74.32,39.25 74.32,39.25 74.32,39.27 74.32,39.29 74.32,39.29 74.32,40.27 74.32,40.27 74.32,40.29 74.32,40.31 74.32,40.31 74.31,41.32 74.31,41.32 74.31,41.34 74.31,41.36 74.31,41.36 74.31,42.37 74.31,42.37 74.31,42.4 74.31,42.42 74.31,42.42 74.31,43.39 74.31,43.39 74.31,43.42 74.31,43.44 74.31,43.44 74.31,43.88 74.31,43.88 74.31,43.9 74.31,43.92 74.31,43.92 74.31,44.35 74.31,44.35 74.31,44.36 74.31,44.39 74.31,44.39 74.31,44.79 74.31,44.79 74.31,44.81 74.31,44.83 74.31,44.83 74.31,45.21 74.31,45.21 74.31,45.22 74.31,45.25 74.31,45.25 74.31,45.59 74.31,45.59 74.31,45.6 74.31,45.63 74.31,45.63 74.31,45.93 74.31,45.93 74.31,45.95 74.31,45.97 74.31,45.97 74.32,46.23 74.32,46.23 74.32,46.25 74.32,46.27 74.32,46.27 74.32,46.49 74.32,46.49 74.32,46.51 74.32,46.53 74.32,46.53 74.32,46.7 74.32,46.7 74.32,46.72 74.32,46.74 74.32,46.74 74.32,46.86 74.32,46.86 74.32,46.88 74.32,46.9 74.32,46.9 74.32,46.96 74.32,46.96 74.32,46.98 74.32,46.99 74.33,47 74.33,47 74.33,47.01 74.33,47.02 74.33,47.03 74.33,47.04 74.34,47.07 74.35,47.17 74.33,47.31 74.29,47.47 74.2,47.62 74.06,47.76 73.97,47.81 73.85,47.85 73.71,47.88 73.54,47.89 47.98,47.89 45.72,45.64 45.71,45.63 45.71,45.63 45.71,45.63 45.69,45.63 45.67,45.62 45.67,45.62 33.7,45.66 31.17,43.11 31.17,43.11 31.16,43.1 31.15,43.08 31.15,43.08 31.15,43.08 31.13,43.08 31.11,43.07 31.11,43.07 31.11,43.07 31.09,43.07 31.07,43.07 31.07,43.07 22.85,43.07 22.84,43.07 22.83,43.07 22.81,43.07 22.8,43.07 22.8,43.07 22.79,43.07 22.78,43.07 22.76,43.07 22.76,43.07 22.71,43.08 22.7,43.07 22.69,43.08 22.68,43.08 22.67,43.08 22.59,43.11 22.59,43.11 22.57,43.12 22.55,43.12 22.55,43.12 22.55,43.12 22.53,43.14 22.52,43.15 22.52,43.15 22.46,43.2 22.46,43.2 22.45,43.21 22.43,43.22 22.43,43.22 22.43,43.22 22.42,43.24 22.42,43.26 22.42,43.26 22.37,43.35 22.36,43.36 22.36,43.36 22.36,43.37 22.36,43.38 22.33,43.52 22.33,43.53 22.33,43.54 22.33,43.55 22.33,43.56 22.33,43.73 22.32,43.74 22.32,43.75 22.32,43.77 22.32,43.77 22.32,44.89 19.39,47.89 5.53,47.89 5.29,47.87 5.09,47.81 4.93,47.73 4.8,47.62 4.71,47.5 4.64,47.35 4.6,47.2 4.58,47.04 4.58,38.51 4.58,38.5 4.58,38.49 4.58,38.47 4.58,38.47 4.58,38.46 4.57,38.45 4.57,38.43 4.57,38.43 4.56,38.43 4.55,38.41 4.54,38.4 4.54,38.4 1.94,35.94 1.92,35.92 1.92,35.92 1.92,35.92 1.9,35.92 1.89,35.91 1.89,35.91 1.88,35.91 1.87,35.91 0.41,35.91 0.3,35.89 0.23,35.86 0.18,35.81 0.14,35.75 0.11,35.62 0.1,35.58 0.1,35.57 0.1,7.13 0.13,6.82 0.21,6.53 0.33,6.27 0.49,6.03 0.68,5.82 0.89,5.63 1.12,5.46 1.36,5.31 1.6,5.18 1.83,5.07 2.04,4.98 2.24,4.9 2.4,4.85 2.53,4.81 2.61,4.79 2.63,4.79 4.7,4.79 4.71,4.79 4.72,4.79 4.74,4.79 4.74,4.78 4.96,4.75 4.97,4.75 4.98,4.75 4.98,4.75 4.99,4.74 5.16,4.68 5.17,4.68 5.18,4.67 5.19,4.67 5.19,4.66 5.29,4.61 5.3,4.61 5.31,4.6 5.32,4.59 5.32,4.58 5.33,4.58 5.33,4.58 5.35,4.57 5.35,4.56 5.36,4.56 5.37,4.55 5.37,4.55 5.38,4.54 7.21,2.38 20.56,2.38 20.72,2.39 20.85,2.42 20.95,2.46 21.03,2.52 21.09,2.6 21.14,2.69 21.17,2.79 21.18,2.92 21.18,3.95 21.18,3.96 21.18,3.97 21.18,3.99 21.18,3.99 21.19,4.17 21.19,4.18 21.2,4.19 21.2,4.2 21.2,4.21 21.24,4.35 21.24,4.36 21.24,4.37 21.25,4.38 21.25,4.38 21.3,4.48 21.31,4.49 21.31,4.5 21.32,4.51 21.33,4.52 21.38,4.58 21.39,4.59 21.4,4.6 21.4,4.6 21.41,4.61 21.47,4.65 21.47,4.66 21.48,4.66 21.49,4.67 21.5,4.67 21.54,4.69 21.55,4.69 21.56,4.7 21.57,4.7 21.58,4.7 21.6,4.71 21.6,4.71 21.61,4.71 21.63,4.72 21.63,4.72 21.63,4.72 21.64,4.72
  pour Bottom: 21.66,4.72 21.66,4.72 29.41,4.72 29.42,4.72 29.43,4.72 29.45,4.72 29.45,4.71 29.65,4.69 29.66,4.69 29.67,4.69 29.67,4.69 29.68,4.68 29.83,4.61 29.85,4.6 29.85,4.6 29.85,4.6 29.87,4.59 29.97,4.49 29.98,4.48 29.98,4.48 29.99,4.47 29.99,4.46 30.06,4.35 30.06,4.35 30.07,4.34 30.07,4.33 30.07,4.32 30.11,4.22 30.11,4.21 30.11,4.2 30.12,4.19 30.12,4.18 30.13,4.1 30.13,4.1 30.13,4.08 30.14,4.07 30.13,4.06 30.14,4.02 30.14,4.02 30.14,4 30.14,3.99 30.14,3.98 30.14,3.97 30.14,1.61 31.77,0.1 47.37,0.1 48.84,1.7 48.84,3.95 48.84,3.96 48.84,3.97 48.84,3.99 48.84,3.99 48.85,4.16 48.85,4.17 48.85,4.18 48.85,4.19 48.86,4.2 48.89,4.33 48.89,4.34 48.89,4.35 48.89,4.36 48.9,4.37 48.94,4.46 48.94,4.47 48.95,4.48 48.95,4.49 48.96,4.49 49,4.56 49.01,4.57 49.02,4.58 49.02,4.58 49.03,4.59 49.07,4.63 49.08,4.64 49.09,4.64 49.09,4.65 49.1,4.65 49.13,4.67 49.14,4.68 49.15,4.69 49.16,4.69 49.17,4.69 49.18,4.7 49.18,4.7 49.2,4.71 49.21,4.71 49.21,4.71 49.23,4.72 49.23,4.72 49.24,4.72 49.25,4.72 57.09,4.72 57.09,4.72 57.11,4.72 57.12,4.72 57.13,4.72 57.31,4.7 57.33,4.7 57.33,4.7 57.34,4.69 57.35,4.69 57.5,4.64 57.51,4.64 57.52,4.63 57.52,4.63 57.53,4.62 57.63,4.55 57.64,4.55 57.65,4.54 57.65,4.54 57.66,4.52 57.72,4.45 57.73,4.44 57.74,4.43 57.74,4.43 57.74,4.41 57.78,4.34 57.78,4.33 57.79,4.32 57.79,4.32 57.79,4.31 57.8,4.25 57.81,4.24 57.81,4.23 57.81,4.22 57.81,4.21 57.81,4.19 57.81,4.18 57.81,4.17 57.82,4.15 57.81,4.15 57.82,4.13 57.82,4.11 57.82,4.11 57.82,4.1 57.82,4.1 57.82,4.08 57.82,4.06 57.82,4.06 57.82,4.02 57.82,4.02 57.82,4 57.83,3.98 57.83,3.98 57.83,3.9 57.83,3.9 57.83,3.88 57.83,3.86 57.83,3.86 57.84,3.74 57.84,3.74 57.84,3.72 57.84,3.7 57.84,3.7 57.84,3.55 57.84,3.55 57.84,3.53 57.84,3.51 57.84,3.51 57.85,3.31 57.85,3.31 57.85,3.29 57.85,3.27 57.85,3.27 57.85,3.02 57.86,2.9 57.88,2.8 57.92,2.72 57.97,2.65 58.1,2.54 58.26,2.47 58.41,2.43 58.56,2.41 58.66,2.41 58.67,2.41 58.68,2.41 58.7,2.41 58.71,2.41 58.72,2.41 71.7,2.41 73.66,4.8 73.66,4.81 73.67,4.82 73.68,4.83 73.69,4.83 73.69,4.84 73.71,4.84 73.72,4.85 73.73,4.85 73.73,4.85 73.74,4.85 73.76,4.85 73.77,4.85 76.43,4.85 76.77,4.88 77.13,4.95 77.49,5.07 77.84,5.24 78.18,5.45 78.49,5.7 78.76,6 78.98,6.33 79.14,6.7 79.19,6.9 79.23,7.11 79.25,7.33 79.25,7.44 79.25,34.5 79.25,34.53 79.24,34.58 79.23,34.67 79.2,34.71 79.13,34.77 79.06,34.79 78.99,34.79 78.97,34.79 78.96,34.79 78.95,34.79 78.94,34.79 78.93,34.79 75.33,34.79 75.32,34.79 75.31,34.79 75.29,34.79 75.29,34.79 75.18,34.8 75.18,34.8 75.16,34.8 75.15,34.8 75.14,34.8 75.05,34.82 75.03,34.82 75.03,34.83 75.02,34.83 75.01,34.84 74.82,34.92 74.81,34.93 74.8,34.93 74.8,34.93 74.79,34.94 74.65,35.06 74.64,35.07 74.63,35.08 74.62,35.08 74.62,35.09 74.52,35.23 74.51,35.23 74.5,35.24 74.5,35.25 74.49,35.26 74.43,35.39 74.42,35.39 74.42,35.4 74.41,35.42 74.41,35.42 74.37,35.53 74.37,35.53 74.37,35.55 74.36,35.56 74.36,35.56 74.34,35.63 74.34,35.63 74.34,35.65 74.33,35.66 74.33,35.66 74.33,35.67 74.33,35.68 74.33,35.69 74.33,35.7 74.33,35.71 74.33,35.72 74.33,35.72 74.33,35.84 74.33,35.96 74.33,35.96 74.33,35.97 74.33,36 74.33,36 74.33,36.17 74.33,36.17 74.33,36.46 74.33,36.46 74.32,36.72 74.32,36.72 74.32,37.11 74.32,37.11 74.32,37.44 74.32,37.44 74.32,37.86 74.32,37.86 74.32,38.3 74.32,38.3 74.32,38.3 74.32,38.34 74.32,38.34 74.32,38.8 74.32,38.8 74.32,39.25 74.32,39.25 74.32,39.27 74.32,39.29 74.32,39.29 74.32,40.27 74.32,40.27 74.32,40.29 74.32,40.31 74.32,40.31 74.31,41.32 74.31,41.32 74.31,41.34 74.31,41.36 74.31,41.36 74.31,42.37 74.31,42.37 74.31,42.4 74.31,42.42 74.31,42.42 74.31,43.39 74.31,43.39 74.31,43.42 74.31,43.44 74.31,43.44 74.31,43.88 74.31,43.88 74.31,43.9 74.31,43.92 74.31,43.92 74.31,44.35 74.31,44.35 74.31,44.36 74.31,44.39 74.31,44.39 74.31,44.79 74.31,44.79 74.31,44.81 74.31,44.83 74.31,44.83 74.31,45.21 74.31,45.21 74.31,45.22 74.31,45.25 74.31,45.25 74.31,45.59 74.31,45.59 74.31,45.6 74.31,45.63 74.31,45.63 74.31,45.93 74.31,45.93 74.31,45.95 74.31,45.97 74.31,45.97 74.32,46.23 74.32,46.23 74.32,46.25 74.32,46.27 74.32,46.27 74.32,46.49 74.32,46.49 74.32,46.51 74.32,46.53 74.32,46.53 74.32,46.7 74.32,46.7 74.32,46.72 74.32,46.74 74.32,46.74 74.32,46.86 74.32,46.86 74.32,46.88 74.32,46.9 74.32,46.9 74.32,46.96 74.32,46.96 74.32,46.98 74.32,46.99 74.33,47 74.33,47 74.33,47.01 74.33,47.02 74.33,47.03 74.33,47.04 74.34,47.07 74.35,47.17 74.33,47.31 74.29,47.47 74.2,47.62 74.06,47.76 73.97,47.81 73.85,47.85 73.71,47.88 73.54,47.89 47.98,47.89 45.69,45.62 45.68,45.61 45.68,45.61 45.68,45.61 45.67,45.61 45.65,45.59 45.65,45.59 33.67,45.64 31.17,43.11 31.17,43.11 31.16,43.1 31.15,43.08 31.15,43.08 31.15,43.08 31.13,43.08 31.11,43.07 31.11,43.07 31.11,43.07 31.09,43.07 31.07,43.07 31.07,43.07 22.85,43.07 22.84,43.07 22.83,43.07 22.81,43.07 22.8,43.07 22.8,43.07 22.79,43.07 22.78,43.07 22.76,43.07 22.76,43.07 22.71,43.08 22.7,43.07 22.69,43.08 22.68,43.08 22.67,43.08 22.59,43.11 22.59,43.11 22.57,43.12 22.55,43.12 22.55,43.12 22.55,43.12 22.53,43.14 22.52,43.15 22.52,43.15 22.46,43.2 22.46,43.2 22.45,43.21 22.43,43.22 22.43,43.22 22.43,43.22 22.42,43.24 22.42,43.26 22.42,43.26 22.37,43.35 22.36,43.36 22.36,43.36 22.36,43.37 22.36,43.38 22.33,43.52 22.33,43.53 22.33,43.54 22.33,43.55 22.33,43.56 22.33,43.73 22.32,43.74 22.32,43.75 22.32,43.77 22.32,43.77 22.32,44.89 19.39,47.89 5.53,47.89 5.29,47.87 5.09,47.81 4.93,47.73 4.8,47.62 4.71,47.5 4.64,47.35 4.6,47.2 4.58,47.04 4.58,38.51 4.58,38.5 4.58,38.49 4.58,38.47 4.58,38.47 4.58,38.46 4.57,38.45 4.57,38.43 4.57,38.43 4.56,38.43 4.55,38.41 4.54,38.4 4.54,38.4 1.94,35.94 1.92,35.92 1.92,35.92 1.92,35.92 1.9,35.92 1.89,35.91 1.89,35.91 1.88,35.91 1.87,35.91 0.41,35.91 0.3,35.89 0.23,35.86 0.18,35.81 0.14,35.75 0.11,35.62 0.1,35.58 0.1,35.57 0.1,7.13 0.13,6.82 0.21,6.53 0.33,6.27 0.49,6.03 0.68,5.82 0.89,5.63 1.12,5.46 1.36,5.31 1.6,5.18 1.83,5.07 2.04,4.98 2.24,4.9 2.4,4.85 2.53,4.81 2.61,4.79 2.63,4.79 4.7,4.79 4.71,4.79 4.72,4.79 4.74,4.79 4.74,4.78 4.96,4.75 4.97,4.75 4.98,4.75 4.98,4.75 4.99,4.74 5.16,4.68 5.17,4.68 5.18,4.67 5.19,4.67 5.19,4.66 5.29,4.61 5.3,4.61 5.31,4.6 5.32,4.59 5.32,4.58 5.33,4.58 5.33,4.58 5.35,4.57 5.35,4.56 5.36,4.56 5.37,4.55 5.37,4.55 5.38,4.54 7.21,2.38 20.56,2.38 20.72,2.39 20.85,2.42 20.95,2.46 21.03,2.52 21.09,2.6 21.14,2.69 21.17,2.79 21.18,2.92 21.18,3.95 21.18,3.96 21.18,3.97 21.18,3.99 21.18,3.99 21.19,4.17 21.19,4.18 21.2,4.19 21.2,4.2 21.2,4.21 21.24,4.35 21.24,4.36 21.24,4.37 21.25,4.38 21.25,4.38 21.3,4.48 21.31,4.49 21.31,4.5 21.32,4.51 21.33,4.52 21.38,4.58 21.39,4.59 21.4,4.6 21.4,4.6 21.41,4.61 21.47,4.65 21.47,4.66 21.48,4.66 21.49,4.67 21.5,4.67 21.54,4.69 21.55,4.69 21.56,4.7 21.57,4.7 21.58,4.7 21.6,4.71 21.6,4.71 21.61,4.71 21.63,4.72 21.63,4.72 21.63,4.72 21.64,4.72
JB_LEFT  (via drill 0.35)
  Top 0.203: v32.18,19.03 25.39,19.03 U1.B2A
  Bottom 0.203: U1.B2B U1.B2A | U3.14 33.45,17.76 v32.18,19.03
JB_RIGHT
  Top 0.203: U2.B2A U2.B2B
  Bottom 0.203: U2.B2A 57.58,13.71 56.07,15.22 U3.12
L1  (via drill 0.35)
  Top 0.203: M1.2 v9.86,35.3
  Bottom 0.203: U3.2 48.38,40.62 47.49,39.73 14.29,39.73 v9.86,35.3
L2  (via drill 0.35)
  Top 0.203: M1.1 8.69,35.34 v8.84,35.19
N$1  (via drill 0.35)
  Top 0.203: C1.1 v3.6,32.13
  Bottom 0.203: R2.1 5.7,26.41 | 5.7,26.41 R1.1 | v3.6,32.13 2.97,31.49 2.97,27.68 4.24,26.41 5.7,26.41
N$2
  Top 0.203: SPEAKER.P$2 34.88,17.04 39.47,21.63 39.47,39.55 43.48,43.55 50.45,43.55 62.72,31.28 64.3,31.28 64.44,31.13 64.44,29.56 65.77,28.24 J2.2
N$8
  Bottom 0.203: U3.13 26.89,15.27 15.48,26.68 R1.2
O  (via drill 0.35)
  Top 0.203: M1.12 21.51,37.17 v21.51,35.17
  Bottom 0.203: v21.51,35.17 21.51,33.9 24.95,30.46 U3.19
OPTIONS  (via drill 0.35)
  Top 0.203: S3.4 S3.1 v6.14,41
  Bottom 0.203: v6.14,41 6.17,40.97 6.17,39.55 8.21,37.51 8.21,34.93 13.03,30.1 14.57,30.1 25.01,19.67 30.08,19.67 33.26,22.84 U3.16
PS_BUTTON  (via drill 0.35)
  Top 0.203: M1.10 v19.12,35.17
  Bottom 0.203: v19.12,35.17 19.12,34.64 25.84,27.92 U3.18
R1  (via drill 0.35)
  Top 0.203: M1.15 24.91,35.4 v24.94,35.37
  Bottom 0.203: U3.20 35.09,32.93 27.81,32.93 26.41,34.33 25.98,34.33 v24.94,35.37
SHARE  (via drill 0.35)
  Top 0.203: S4.1 S4.4 69.63,43.69 60.8,43.69 58.76,41.65 v55.04,41.65
  Bottom 0.203: U3.11 54.85,17.76 54.85,20.59 54.53,20.91 54.53,31.91 55.04,32.42 v55.04,41.65
SIG  (via drill 0.35)
  Top 0.203: v39.67,8 S2.2
  Bottom 0.203: R2.2 15.53,21.7 18.36,21.7 32.06,8 v39.67,8
SPEAKER  (via drill 0.35)  (1 unrouted)
  Top 0.203: v31.92,23.74 31.98,23.8
  Top 0.406: J2.1 70.5,21.15 59.74,21.15 57.53,18.94 50.44,18.94 v48.05,21.33
  Bottom 0.406: v48.05,21.33 44.88,21.33 42.38,23.83 32.01,23.83 v31.92,23.74
SQUARE  (via drill 0.35)
  Top 0.203: M1.18 28.39,35.37 v28.37,35.35
  Bottom 0.203: U3.5 38.07,33 36.8,34.27 34.4,34.27 33.66,35.01 28.37,35.01 v28.37,35.35
TO_AMP  (via drill 0.35)
  Top 0.203: v46.15,12.44 46.15,22.26 | v37.67,9.99 37.17,9.49 S2.3
  Top 0.305: 46.15,22.26 55.38,22.26 AMP.5
  Bottom 0.203: v46.15,12.44 40.12,12.44 v37.67,9.99
TO_TRRS  (via drill 0.35)
  Top 0.203: v67.74,17.52 66.92,17.52 61.24,11.84 55.37,11.84 48.56,5.03 S2.1
  Bottom 0.203: v67.74,17.52 69.47,19.26 69.47,22.15 65.36,26.27 J1.TIP
TRIANGLE  (via drill 0.35)
  Top 0.203: M1.13 22.6,35.58 v22.91,35.27
  Bottom 0.203: U3.6 39.34,30.46 37.84,31.96 26.22,31.96 v22.91,35.27
TRKPD  (via drill 0.35)
  Top 0.203: v37.64,20.7 37.64,37.54 37.63,37.54 S5.3
  Bottom 0.203: U3.15 37.24,20.3 v37.64,20.7
VCC  (via drill 0.35)
  Top 0.406: U2.V1 60.76,12.98 U2.H1 53.93,11.17 44.88,11.17 | 44.88,11.17 v44.88,42.92 | U1.V1 16.8,15.12 20.74,11.17 44.88,11.17
  Bottom 0.203: U3.24 35.4,42.92
  Bottom 0.406: U1.H1 10.5,12.98 U1.V1 | 35.4,42.92 v44.88,42.92 | U2.V1 67.06,21.37 64.55,23.89 64.55,26.73 63.76,27.51 62.32,28.95 AMP.2
X  (via drill 0.35)
  Top 0.203: M1.11 20.28,35.34 v20.18,35.24
  Bottom 0.203: U3.7 52.93,27.94 40.47,27.94 36.93,31.48 25.17,31.48 22.14,34.51 22.14,35.44 21.77,35.81 21.25,35.81 20.68,35.24 v20.18,35.24
(copper drawn outside any net)
  shapes: Top area x1

### Text on the board
Bottom: Becky Stern 2024 / ver. 3
bPlace: GND | 4-8Ω